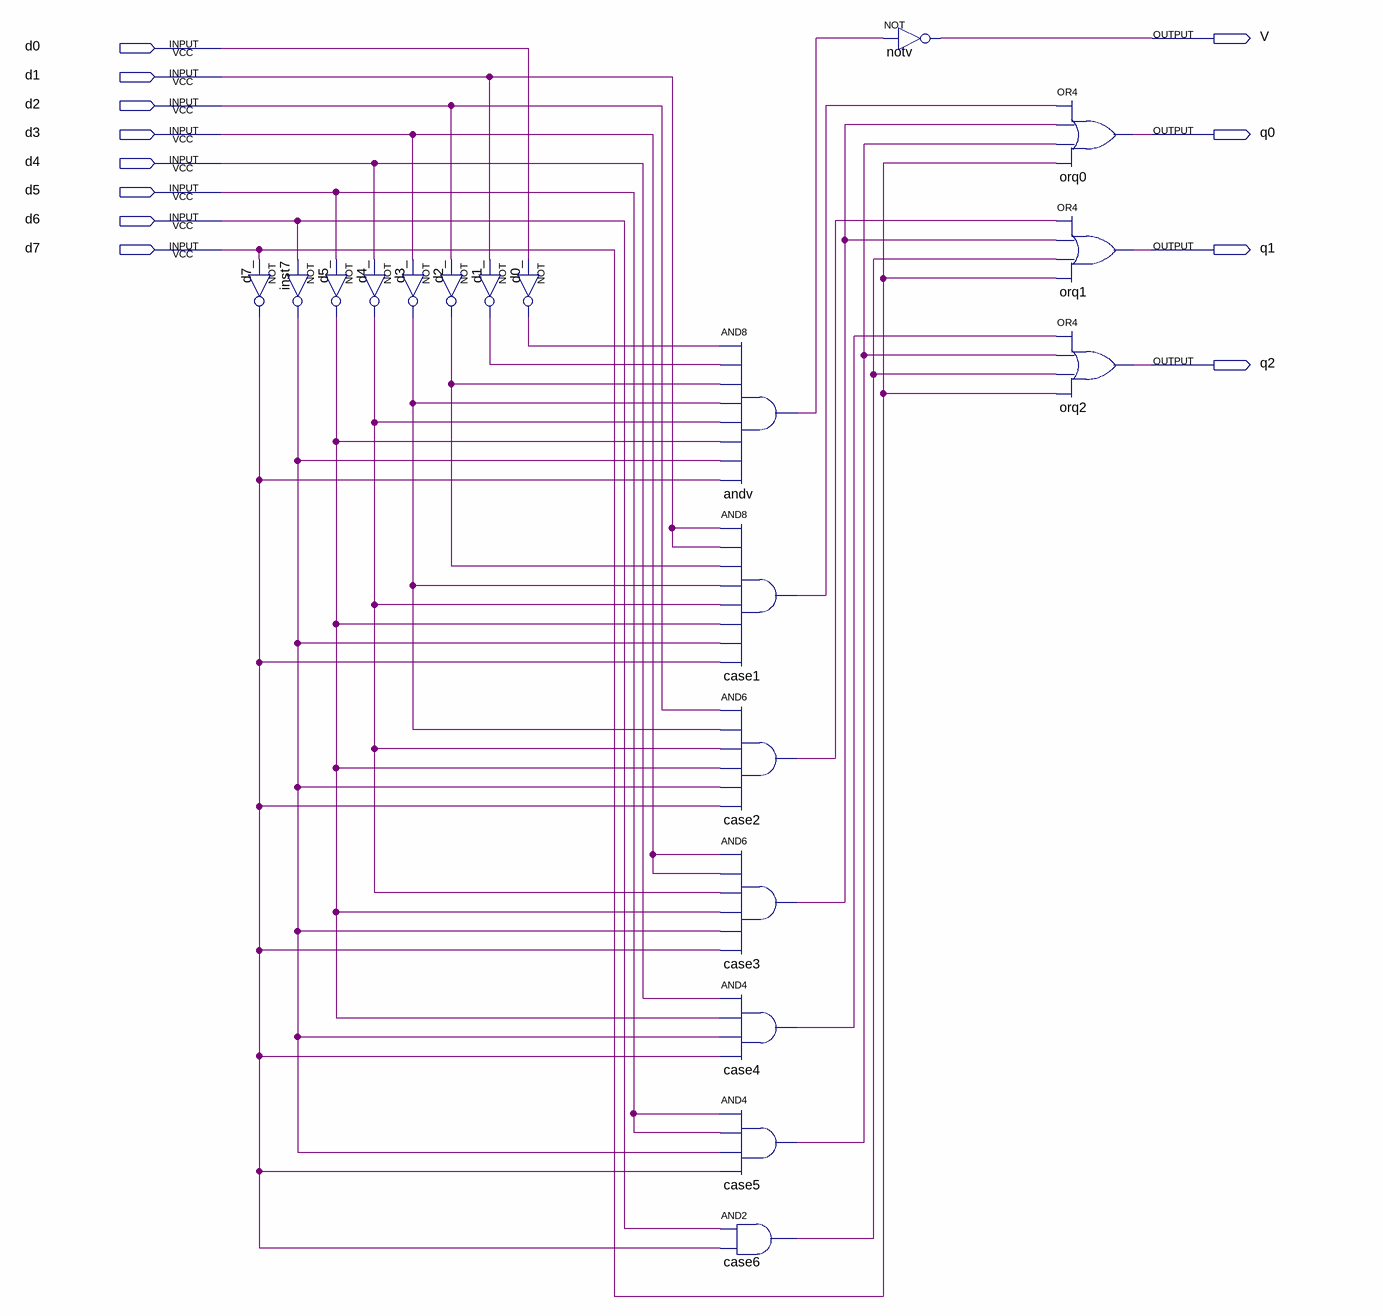
[diagram p0: schematic sheet]
// Quartus schematic priority_encoder_83_circuit.bdf as structural Verilog: 19 symbols, 12 pins
module priority_encoder_83_circuit (
  input  d0,
  input  d1,
  input  d2,
  input  d3,
  input  d4,
  input  d5,
  input  d6,
  input  d7,
  output V,
  output q0,
  output q1,
  output q2
);

  wire andv_out, case1_out, case2_out, case3_out, case4_out, case5_out, case6_out, d0__out, d1__out, d2__out,
       d3__out, d4__out, d5__out, d7__out, inst7_out;

  not inst7 (inst7_out, d6);
  not d7_ (d7__out, d7);
  not d5_ (d5__out, d5);
  not d4_ (d4__out, d4);
  not d3_ (d3__out, d3);
  not d2_ (d2__out, d2);
  not d1_ (d1__out, d1);
  not d0_ (d0__out, d0);
  and andv (andv_out, d0__out, d1__out, d2__out, d3__out, d4__out, d5__out, inst7_out, d7__out);
  and case1 (case1_out, d1, d1, d2__out, d3__out, d4__out, d5__out, inst7_out, d7__out);
  and case2 (case2_out, d2, d3__out, d4__out, d5__out, inst7_out, d7__out);
  and case3 (case3_out, d3, d3, d4__out, d5__out, inst7_out, d7__out);
  and case4 (case4_out, d4, d5__out, inst7_out, d7__out);
  and case5 (case5_out, d5, d5, inst7_out, d7__out);
  and case6 (case6_out, d6, d7__out);
  not notv (V, andv_out);
  or orq0 (q0, case1_out, case3_out, case5_out, d7);
  or orq1 (q1, case2_out, case3_out, case6_out, d7);
  or orq2 (q2, case4_out, case5_out, case6_out, d7);
endmodule
